# EAGLE schematic system (EAGLE 7.1.0)
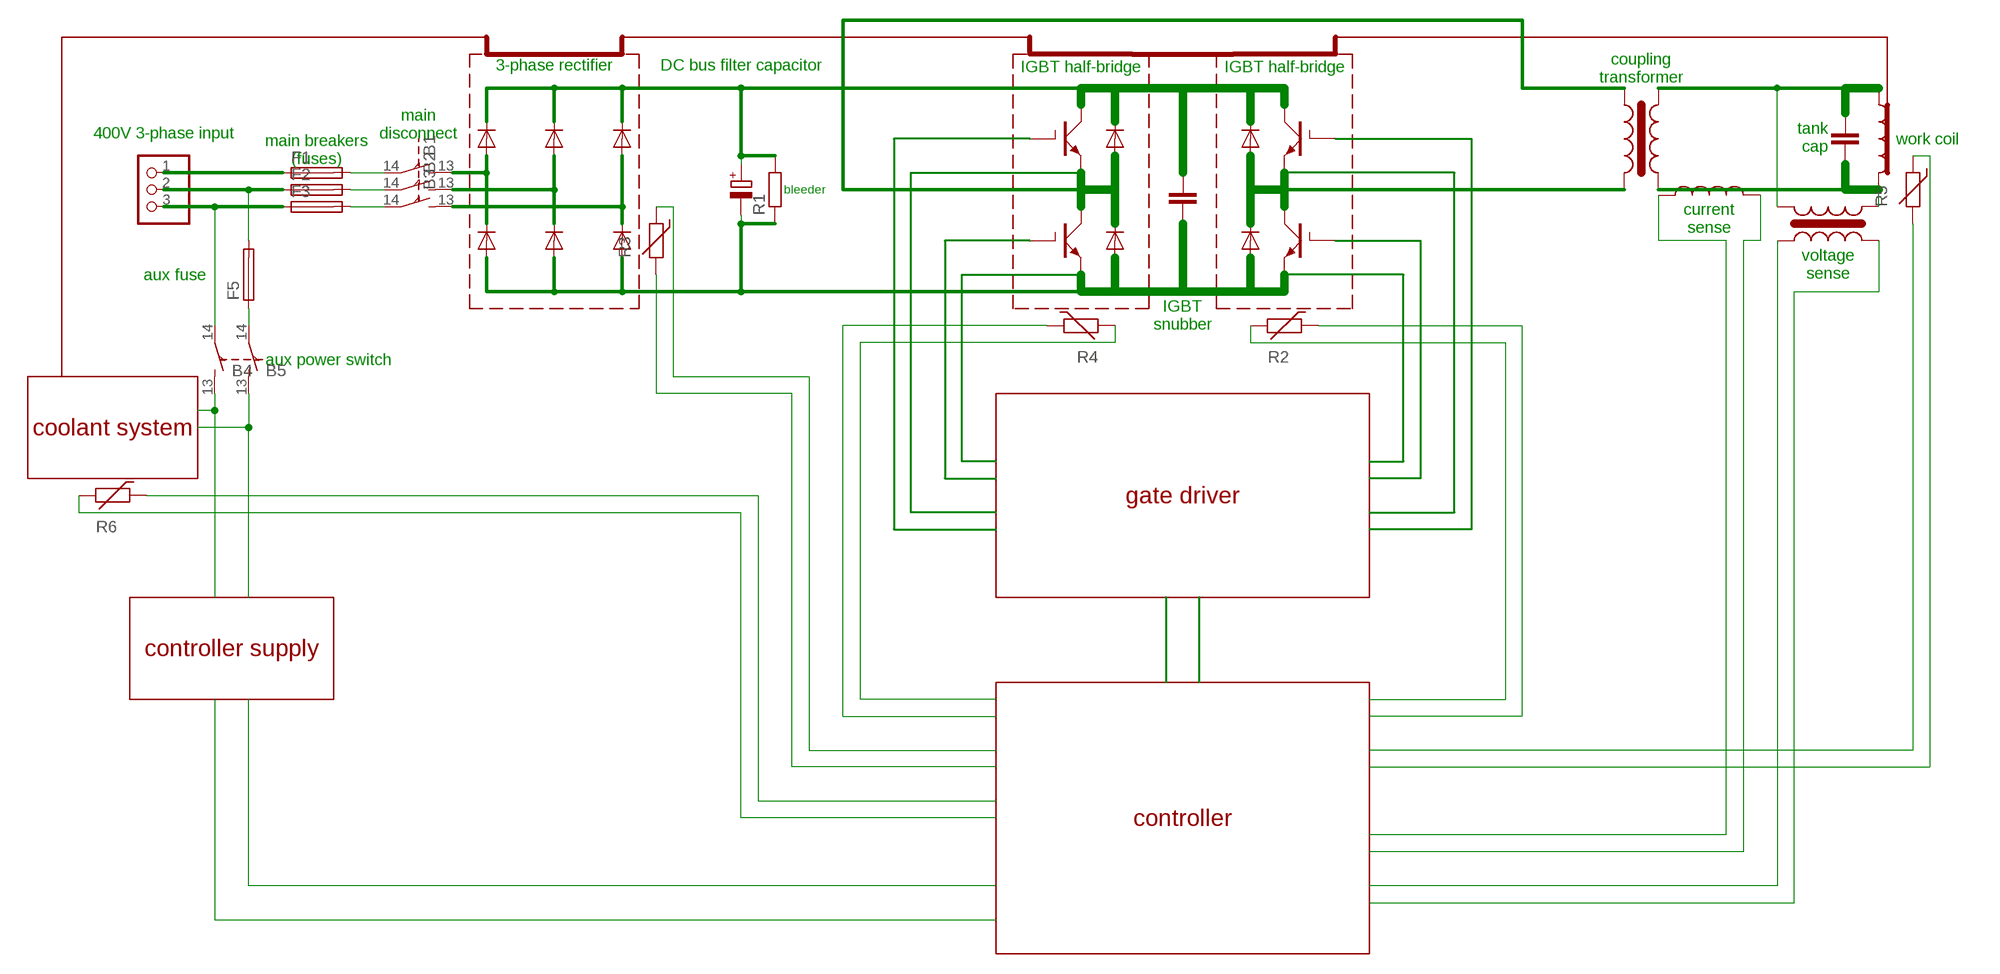
[diagram p0: schematic, sheet 1]

## Parts
B1  ENDSCHALTER_SCHLIESSER  [ENDSCHALTER_SCHLIESSER]
B2  ENDSCHALTER_SCHLIESSER  [ENDSCHALTER_SCHLIESSER]
B3  ENDSCHALTER_SCHLIESSER  [ENDSCHALTER_SCHLIESSER]
B4  ENDSCHALTER_SCHLIESSER  [ENDSCHALTER_SCHLIESSER]
B5  ENDSCHALTER_SCHLIESSER  [ENDSCHALTER_SCHLIESSER]
C1  CPOL-EU085CS-1AR  [085CS_1AR]
C2  C-EU025-024X044  [C025-024X044]
C3  C-EU025-024X044  [C025-024X044]
D1  1N4004  [DO41-10]
D2  1N4004  [DO41-10]
D3  1N4004  [DO41-10]
D4  1N4004  [DO41-10]
D5  1N4004  [DO41-10]
D6  1N4004  [DO41-10]
D7  1N4004  [DO41-10]
D8  1N4004  [DO41-10]
D9  1N4004  [DO41-10]
D10  1N4004  [DO41-10]
F1  GSH15  [GSH15]
F2  GSH15  [GSH15]
F3  GSH15  [GSH15]
F5  GSH15  [GSH15]
JP1  PINHD-1X3  [1X03]
L1  L-US0204/5  [0204/5]
L12  L-US0204/5  [0204/5]
L13  L-US0204/5  [0204/5]
L14  L-US0204/5  [0204/5]
L15  L-US0204/5  [0204/5]
L16  L-US0204/5  [0204/5]
Q1  IXGT6N170  [TO268]
Q2  IXGT6N170  [TO268]
Q3  IXGT6N170  [TO268]
Q4  IXGT6N170  [TO268]
R1  R-EU_0204/2V  [0204V]
R2  THERMISTOR-2,5  [RS-2,5]
R3  THERMISTOR-2,5  [RS-2,5]
R4  THERMISTOR-2,5  [RS-2,5]
R5  THERMISTOR-2,5  [RS-2,5]
R6  THERMISTOR-2,5  [RS-2,5]

## Nets
N$1: D1.C D8.A L13.1 Q1.C@1(C) Q1.C@2(C) Q2.E
N$2: C1.- C3.2 D1.A D3.A D5.A D7.A D9.A Q1.E Q3.E R1.1
N$3: B1.13 D2.A D3.C
N$4: Q4.G
N$5: C1.+ C3.1 D2.C D4.C D6.C D8.C D10.C Q2.C@1(C) Q2.C@2(C) Q4.C@1(C) Q4.C@2(C) R1.2
N$6: F2.1 F5.2 JP1.2
N$7: B4.14 F3.1 JP1.3
N$8: D9.C D10.A L13.2 Q3.C@1(C) Q3.C@2(C) Q4.E
N$10: R5.1
N$11: Q3.G
N$12: C2.2 L1.2 L14.2 L15.1
N$14: C2.1 L1.1 L14.1 L15.2
N$16: R5.2
N$17: R2.1
N$18: R6.2
N$22: R2.2
N$23: Q2.G
N$24: R4.1
N$25: B2.13 D4.A D5.C
N$26: B3.13 D6.A D7.C
N$27: F1.1 JP1.1
N$28: B1.14 F1.2
N$29: B2.14 F2.2
N$30: B3.14 F3.2
N$31: R4.2
N$32: B5.14 F5.1
N$33: L12.1
N$34: L12.2
N$35: R3.2
N$36: L16.1
N$37: L16.2
N$38: R3.1
N$40: B5.13
N$41: R6.1
N$42: Q1.G
N$46: B4.13

## Notes on the sheet
- IGBT half-bridge | IGBT half-bridge
- 3-phase rectifier | DC bus filter capacitor
- coupling
  transformer
- tank
  cap
- 400V 3-phase input
- main
  disconnect
- work coil
- main breakers
  (fuses)
- bleeder
- current
  sense
- voltage
  sense
- aux fuse
- IGBT
  snubber
- aux power switch
- coolant system
- gate driver
- controller supply
- controller

## Library data of the parts
B1-B5 = e-schalter:ENDSCHALTER_SCHLIESSER: Endschalter, Schließer
C1 = rcl:CPOL-EU: POLARIZED CAPACITOR, European symbol
C2 C3 = rcl:C-EU: CAPACITOR, European symbol
D1-D10 = diode:1N4004: DIODE general purpose rectifier, 1 A
F1-F3 F5 = fuse:GSH15: FUSE HOLDER grid 15mm, 19649 Wickmann; MPN: 64900001039; OC_FARNELL: 1271673; OC_NEWARK: 02P0318
JP1 = pinhead:PINHD-1X3: PIN HEADER
L1 L12-L16 = rcl:L-US: INDUCTOR, American symbol
Q1-Q4 = transistor-power:IXG?*N170: High Voltage IGBT Source: http://www.ixys.com/98989.pdf
R1 = rcl:R-EU_: RESISTOR, European symbol
R2-R6 = varistor:THERMISTOR: THERMISTOR